# EAGLE design BatNode (EAGLE 7.1.0)
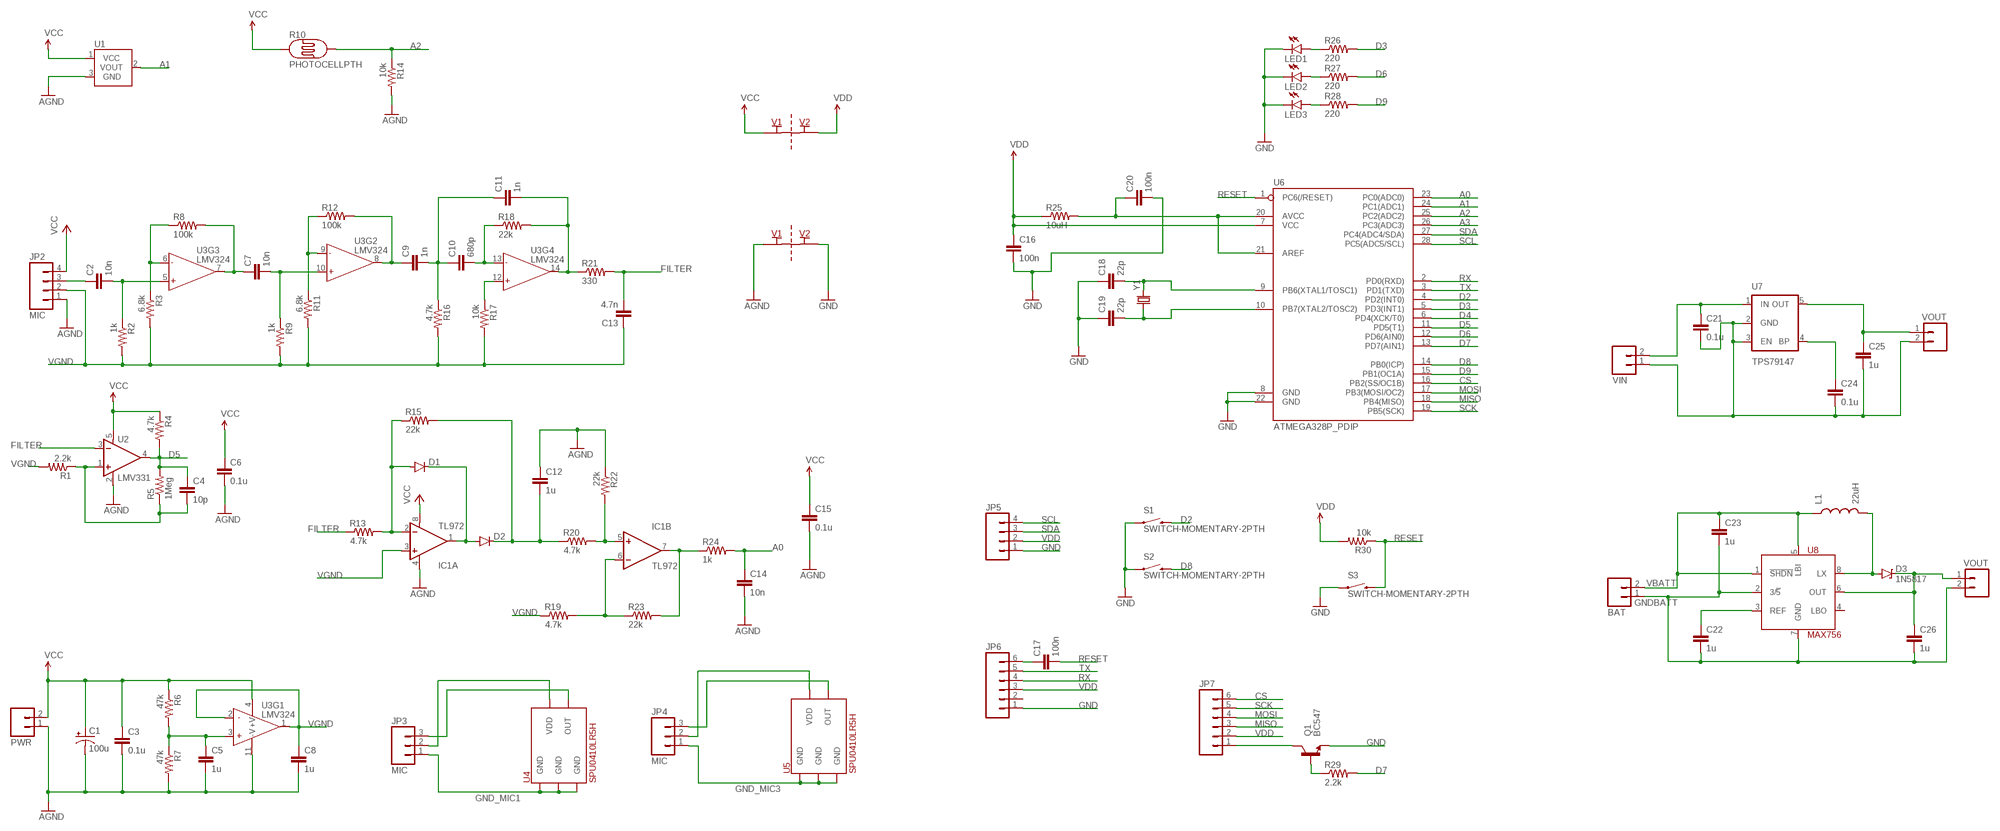
[diagram p0: schematic, sheet 1]

## Parts
C1  100u  CAP_POLPTH1  [CPOL-RADIAL-100UF-25V]
C2  10n  C-EU025-030X050  [C025-030X050]
C3  0.1u  1.0UF-25V-+80/-20(0805)  [0805]
C4  10p  C-EU025-030X050  [C025-030X050]
C5  1u  1.0UF-25V-+80/-20(0805)  [0805]
C6  0.1u  1.0UF-25V-+80/-20(0805)  [0805]
C7  10n  C-EU025-030X050  [C025-030X050]
C8  1u  1.0UF-25V-+80/-20(0805)  [0805]
C9  1n  C-EU025-030X050  [C025-030X050]
C10  680p  C-EU025-030X050  [C025-030X050]
C11  1n  C-EU025-030X050  [C025-030X050]
C12  1u  C-EU025-030X050  [C025-030X050]
C13  4.7n  C-EU025-030X050  [C025-030X050]
C14  10n  C-EU025-030X050  [C025-030X050]
C15  0.1u  1.0UF-25V-+80/-20(0805)  [0805]
C16  100n  CAP0805  [0805]
C17  100n  CAP0805  [0805]
C18  22p  CAPPTH  [CAP-PTH-SMALL]
C19  22p  CAPPTH  [CAP-PTH-SMALL]
C20  100n  CAP0805  [0805]
C21  0.1u  1.0UF-25V-+80/-20(0805)  [0805]
C22  1u  C-EU025-030X050  [C025-030X050]
C23  1u  C-EU025-030X050  [C025-030X050]
C24  0.1u  1.0UF-25V-+80/-20(0805)  [0805]
C25  1u  C-EU025-030X050  [C025-030X050]
C26  1u  C-EU025-030X050  [C025-030X050]
D1  DIODE1N4148  [DIODE-1N4148]
D2  DIODE1N4148  [DIODE-1N4148]
D3  1N5817  DIODE-ZENERPTH  [DIODE-ZENER]
IC1  TL972  OPAMP-DUALU  [SO08]
JP1  PWR  M02LOCK  [1X02_LOCK]
JP2  MIC  M04PTH  [1X04]
JP3  MIC  M03LOCK  [1X03_LOCK]
JP4  MIC  M03LOCK  [1X03_LOCK]
JP5  M04LOCK  [1X04_LOCK]
JP6  M06LOCK  [1X06_LOCK]
JP7  M06LOCK  [1X06_LOCK]
JP8  BAT  M02LOCK  [1X02_LOCK]
JP9  VIN  M02LOCK  [1X02_LOCK]
JP10  VOUT  M02LOCK  [1X02_LOCK]
JP11  VOUT  M02LOCK  [1X02_LOCK]
L1  22uH  INDUCTORC2020  [C2020]
LED1  LED5MM  [LED5MM]
LED2  LED5MM  [LED5MM]
LED3  LED5MM  [LED5MM]
Q1  BC547  TRANSISTOR_NPNBC547  [TO-92-AMMO]
R1  2.2k  RESISTORAXIAL-0.3  [AXIAL-0.3]
R2  1k  RESISTORAXIAL-0.3  [AXIAL-0.3]
R3  6.8k  RESISTORAXIAL-0.3  [AXIAL-0.3]
R4  4.7k  RESISTORAXIAL-0.3  [AXIAL-0.3]
R5  1Meg  RESISTORAXIAL-0.3  [AXIAL-0.3]
R6  47k  RESISTORAXIAL-0.3  [AXIAL-0.3]
R7  47k  RESISTORAXIAL-0.3  [AXIAL-0.3]
R8  100k  RESISTORAXIAL-0.3  [AXIAL-0.3]
R9  1k  RESISTORAXIAL-0.3  [AXIAL-0.3]
R10  PHOTOCELLPTH  [PHOTOCELL]
R11  6.8k  RESISTORAXIAL-0.3  [AXIAL-0.3]
R12  100k  RESISTORAXIAL-0.3  [AXIAL-0.3]
R13  4.7k  RESISTORAXIAL-0.3  [AXIAL-0.3]
R14  10k  RESISTORAXIAL-0.3  [AXIAL-0.3]
R15  22k  RESISTORAXIAL-0.3  [AXIAL-0.3]
R16  4.7k  RESISTORAXIAL-0.3  [AXIAL-0.3]
R17  10k  RESISTORAXIAL-0.3  [AXIAL-0.3]
R18  22k  RESISTORAXIAL-0.3  [AXIAL-0.3]
R19  4.7k  RESISTORAXIAL-0.3  [AXIAL-0.3]
R20  4.7k  RESISTORAXIAL-0.3  [AXIAL-0.3]
R21  330  RESISTORAXIAL-0.3  [AXIAL-0.3]
R22  22k  RESISTORAXIAL-0.3  [AXIAL-0.3]
R23  22k  RESISTORAXIAL-0.3  [AXIAL-0.3]
R24  1k  RESISTORAXIAL-0.3  [AXIAL-0.3]
R25  10uH  RESISTORAXIAL-0.3  [AXIAL-0.3]
R26  220  RESISTORAXIAL-0.3  [AXIAL-0.3]
R27  220  RESISTORAXIAL-0.3  [AXIAL-0.3]
R28  220  RESISTORAXIAL-0.3  [AXIAL-0.3]
R29  2.2k  RESISTORAXIAL-0.3  [AXIAL-0.3]
R30  10k  RESISTORAXIAL-0.3  [AXIAL-0.3]
S1  SWITCH-MOMENTARY-2PTH  [TACTILE-PTH]
S2  SWITCH-MOMENTARY-2PTH  [TACTILE-PTH]
S3  SWITCH-MOMENTARY-2PTH  [TACTILE-PTH]
U1  TMP36GT9  [TO-92]
U2  LMV331  LMV339  [SOT23-5]
U3  LMV324  [SO014]
U4  SPU0410LR5H  [SPU0410LR5H]
U5  SPU0410LR5H  [SPU0410LR5H]
U6  ATMEGA328P_PDIP  [DIL28-3]
U7  TPS79147  V_REG_LDOSMD  [SOT23-5]
U8  MAX756  [SO08]
X11  SUPPLY_CONNECT  [2PT_GND_TIE]
X12  SUPPLY_CONNECT  [2PT_GND_TIE]
Y1  CRYSTALHC49UV  [HC49U-V]

## Nets
A0: C14.1 R24.P$2 U6.23(PC0(ADC0))
A1: U1.2(VOUT) U6.24(PC1(ADC1))
A2: R10.2 R14.P$1 U6.25(PC2(ADC2))
A3: U6.26(PC3(ADC3))
AGND: C1.2(-) C3.2 C5.2 C6.2 C8.2 C12.1 C14.2 C15.2 IC1.4(A:V-) JP1.1 JP2.1 R7.P$2 R14.P$2 R22.P$1 U1.3(GND) U2.2(V-) U3.11(-V) X12.P$1
CS: JP7.6 U6.16(PB2(SS/OC1B))
D2: S1.3 U6.4(PD2(INT0))
D3: R26.P$2 U6.5(PD3(INT1))
D4: U6.6(PD4(XCK/T0))
D5: C4.1 R4.P$2 R5.P$2 U2.4(OUT) U6.11(PD5(T1))
D6: R27.P$2 U6.12(PD6(AIN0))
D7: R29.P$2 U6.13(PD7(AIN1))
D8: S2.3 U6.14(PB0(ICP))
D9: R28.P$2 U6.15(PB1(OC1A))
FILTER: C13.2 R13.P$1 R21.P$2 U2.3(-IN)
GND: C16.2 C18.1 C19.1 C20.2 JP5.1 JP6.1 LED1.K(C) LED2.K(C) LED3.K(C) Q1.3(E) S1.1 S2.1 S3.1 U6.8(GND) U6.22(GND) X12.P$2
GND_MIC1: JP3.1 U4.2(GND) U4.3(GND) U4.5(GND)
GND_MIC3: JP4.1 U5.2(GND) U5.3(GND) U5.5(GND)
GNDBATT: C22.2 C23.2 C26.2 JP8.1 JP11.2 U8.2(3/!5) U8.7(GND)
GNDIN: C21.2 C24.2 C25.2 JP9.1 JP10.2 U7.2(GND) U7.3(EN)
MISO: JP7.3 U6.18(PB4(MISO))
MOSI: JP7.4 U6.17(PB3(MOSI/OC2))
N$1: C5.1 R6.P$2 R7.P$1 U3.3(+IN)
N$2: C2.2 R2.P$1 U3.5(+IN)
N$3: R3.P$1 R8.P$1 U3.6(-IN)
N$4: C7.1 R8.P$2 U3.7(OUT)
N$5: C7.2 R9.P$1 U3.10(+IN)
N$6: C9.1 R12.P$2 U3.8(OUT)
N$7: R11.P$1 R12.P$1 U3.9(-IN)
N$8: C9.2 C10.1 C11.1 R16.P$1
N$9: R17.P$1 U3.12(+IN)
N$10: C10.2 R18.P$1 U3.13(-IN)
N$12: C2.1 JP2.3
N$13: C4.2 R1.P$1 R5.P$1 U2.1(+IN)
N$14: C17.1 JP6.6
N$15: JP3.2 U4.4(VDD)
N$16: JP3.3 U4.1(OUT)
N$17: C18.2 U6.9(PB6(XTAL1/TOSC1)) Y1.2
N$18: C19.2 U6.10(PB7(XTAL2/TOSC2)) Y1.1
N$19: JP7.1 Q1.1(C)
N$20: C20.1 R25.P$2 U6.20(AVCC) U6.21(AREF)
N$21: JP4.2 U5.4(VDD)
N$22: Q1.2(B) R29.P$1
N$23: LED1.A R26.P$1
N$24: LED2.A R27.P$1
N$25: LED3.A R28.P$1
N$26: D3.P$2(A) L1.P$2 U8.8(LX)
N$27: C24.1 U7.4(BP)
N$28: D1.A IC1.2(A:-IN) R13.P$2 R15.P$1
N$29: JP4.3 U5.1(OUT)
N$30: D1.C D2.A IC1.1(A:OUT)
N$31: IC1.5(B:+IN) R20.P$2 R22.P$2
N$32: C12.2 D2.C R15.P$2 R20.P$1
N$33: IC1.6(B:-IN) R19.P$2 R23.P$1
N$34: C26.1 D3.P$1(C) JP11.1 U8.6(OUT)
N$35: C22.1 U8.3(REF)
RESET: C17.2 R30.P$1 S3.3 U6.1(PC6(/RESET))
RX: JP6.4 U6.2(PD0(RXD))
SCK: JP7.5 U6.19(PB5(SCK))
SCL: JP5.4 U6.28(PC5(ADC5/SCL))
SDA: JP5.3 U6.27(PC4(ADC4/SDA))
TX: JP6.5 U6.3(PD1(TXD))
VBATT: C23.1 JP8.2 L1.P$1 U8.1(!SHDN) U8.5(LBI)
VCC: C1.1(+) C3.1 C6.1 C15.1 IC1.8(A:V+) JP1.2 JP2.4 R4.P$1 R6.P$1 R10.1 U1.1(VCC) U2.5(V+) U3.4(+V) X11.P$1
VDD: C16.1 JP5.2 JP6.3 JP7.2 R25.P$1 R30.P$2 U6.7(VCC) X11.P$2
VGND: C8.1 C13.1 IC1.3(A:+IN) JP2.2 R1.P$2 R2.P$2 R3.P$2 R9.P$2 R11.P$2 R16.P$2 R17.P$2 R19.P$1 U3.1(OUT) U3.2(-IN)
VIN: C21.1 JP9.2 U7.1(IN)
VOUT: C25.1 JP10.1 U7.5(OUT)
X1: IC1.7(B:OUT) R23.P$2 R24.P$1
XXX: C11.2 R18.P$2 R21.P$1 U3.14(OUT)
Unconnected: JP6.2 U8.4(LBO)

## Library data of the parts
C1 = SparkFun-Capacitors:CAP_POL: Capacitor Polarized These are standard SMD and PTH capacitors. Normally 10uF, 47uF, and 100uF in electrolytic and tantalum varieties. Always verify the external diameter of the through hole cap, it varies with capacity, voltage, and manufacturer. The EIA devices should be standard.
C2 C4 C7 C9-C14 C22 C23 C25 C26 = resistor:C-EU: CAPACITOR, European symbol; SPICEPREFIX: C
C3 C5 C6 C8 C15 C21 C24 = SparkFun-Capacitors:1.0UF-25V-+80/-20(0805): CAP-11625; PROD_ID: CAP-11625; VALUE: 1.0uF
C16 C17 C20 = SparkFun-Passives:CAP: Capacitor Standard 0603 ceramic capacitor, and 0.1" leaded capacitor.
C18 C19 = SparkFun-Capacitors:CAP: Capacitor Standard 0603 ceramic capacitor, and 0.1" leaded capacitor.
D1 D2 = SparkFun-DiscreteSemi:DIODE: Diode These are standard reverse protection diodes and small signal diodes. SMA package can handle up to about 1A. SOD-323 can handle about 200mA. What the SOD-323 package when ordering, there are some mfgs out there that are 5-pin packages.
D3 = SparkFun-DiscreteSemi:DIODE-ZENER: Zener Diode Production Part - 8199 3.4V Zener Voltage
IC1 = SparkFun-AnalogIC:OPAMP-DUAL: Generic op-amp footprint
JP1 JP8-JP11 = SparkFun-Connectors:M02: Standard 2-pin 0.1" header. Use with - straight break away headers ( PRT-00116) - right angle break away headers (PRT-00553) - swiss pins (PRT-00743) - machine pins (PRT-00117) - female headers (PRT-00115) Molex polarized connector foot print use with: PRT-08233 with associated crimp pins and housings. 2.54_SCREWTERM for use with PRT-10571. 3.5mm Screw Terminal footprints for PRT-08084 5mm Screw Terminal footprints for use with PRT-08432
JP2 JP5 = SparkFun-Connectors:M04: Header 4 Standard 4-pin 0.1" header. Use with straight break away headers (SKU : PRT-00116), right angle break away headers (PRT-00553), swiss pins (PRT-00743), machine pins (PRT-00117), and female headers (PRT-00115). Molex polarized connector foot print use with SKU : PRT-08231 with associated crimp pins and housings. 1MM SMD Version SKU: PRT-10208
JP3 JP4 = SparkFun-Connectors:M03: Header 3 Standard 3-pin 0.1" header. Use with straight break away headers (SKU : PRT-00116), right angle break away headers (PRT-00553), swiss pins (PRT-00743), machine pins (PRT-00117), and female headers (PRT-00115). Molex polarized connector foot print use with SKU : PRT-08232 with associated crimp pins and housings.
JP6 JP7 = SparkFun-Connectors:M06: Header 6 Standard 6-pin 0.1" header. Use with straight break away headers (SKU : PRT-00116), right angle break away headers (PRT-00553), swiss pins (PRT-00743), machine pins (PRT-00117), and female headers (PRT-00115). Molex polarized connector foot print use with SKU : PRT-08094 with associated crimp pins and housings. NOTES ON THE VARIANTS LOCK and LOCK_LONGPADS... This footprint was designed to help hold the alignment of a through-hole component (i.e. 6-pin header) while soldering it into place. You may notice that each hole has been shifted either up or down by 0.005 of an inch from it's more standard position (which is a perfectly straight line). This slight alteration caused the pins (the squares in the middle) to touch the edges of the holes. Because they are alternating, it causes a "brace" to hold the component in place. 0.005 has proven to be the perfect amount of "off-center" position when using our standard breakaway headers. Although looks a little odd when you look at the bare footprint, once you have a header in there, the alteration is very hard to notice. Also,if you push a header all the way into place, it is covered up entirely on the bottom side. This idea of altering the position of holes to aid alignment will be further integrated into the Sparkfun Library for other footprints. It can help hold any component with 3 or more connection pins.
L1 = BatNodeParts:INDUCTOR: Inductors Basic Inductor/Choke - 0603 and 1206. Footprints are not proven and vary greatly between part numbers. SRN6045- 33uH, 20% 1.4A SDR0403-560KL - 56uH, 10%, 500mA RMS/740mA peak
LED1-LED3 = SparkFun-LED:LED: LEDs Standard schematic elements and footprints for 5mm, 3mm, 1206, and 0603 sized LEDs. 5mm - Spark Fun Electronics SKU : COM-00529 (and others)
Q1 = SparkFun-DiscreteSemi:TRANSISTOR_NPN: Generic NPN BJT MMBT2222A - TRANS-08049 (SOT-23, 1A 40V) MPSA42 - TRANS-09116 (SOT-23, 500mA 300V) MMBT5088LT1G - TRANS-11160 (SOT-23, 50 mA 30V) BC547 - COM-08928 <http://www.sparkfun.com/products/8928> (TO-92 45V 100mA) (1.Collector 2.Base 3.Emitter) 2N3904 - COM-00521 <http://www.sparkfun.com/products/521> (TO-92 40V 200mA) (1.Emitter 2.Base 3.Collector) P2N2222A - COM-12852 <http://www.sparkfun.com/products/12852> (TO-92 40V 600mA) (1.Collector 2.Base 3.Emitter)
R1-R9 R11-R25 = SparkFun-Passives:RESISTOR: Resistor Basic schematic elements and footprints for 0603, 1206, and PTH resistors.
R10 = SparkFun-Sensors:PHOTOCELL: CdS photoresistor. This is a low cost way to detect light levels. Resistance decreases with more incoming light. SparkFun SKU: SEN-09088
R26-R30 = SparkFun-Resistors:RESISTOR: Resistor Basic schematic elements and footprints for 0603, 1206, and PTH resistors.
S1-S3 = SparkFun-Electromechanical:SWITCH-MOMENTARY-2: Various NO switches- pushbuttons, reed, etc
U1 = SparkFun-Sensors:TMP36: Precision degC temp sensor, analog out
U2 = BatNodeParts:LMV339: LMV339 Comparator
U3 = SparkFun-AnalogIC:LMV324: Jellybean quad op-amp; PROD_ID: IC-08227
U4 U5 = BatNodeParts:SPU0410LR5H
U6 = SparkFun-DigitalIC:ATMEGA328P_PDIP: uC used in the Arduino 32kb flash, 1k EEPROM, 2k SRAM This is the through-hole version of this chip.
U7 = SparkFun-PowerIC:V_REG_LDO: Voltage Regulator LDO Standard 150mA LDO voltage regulator in SOT-23 layout. Micrel part MIC5205. BP (by-pass) pin is used to lower output noise with 470pF cap.
U8 = BatNodeParts:MAX756
X11 X12 = SparkFun-Passives:SUPPLY_CONNECT
Y1 = SparkFun-FreqCtrl:CRYSTAL: Various standard crystals. Proven footprints.

## Board
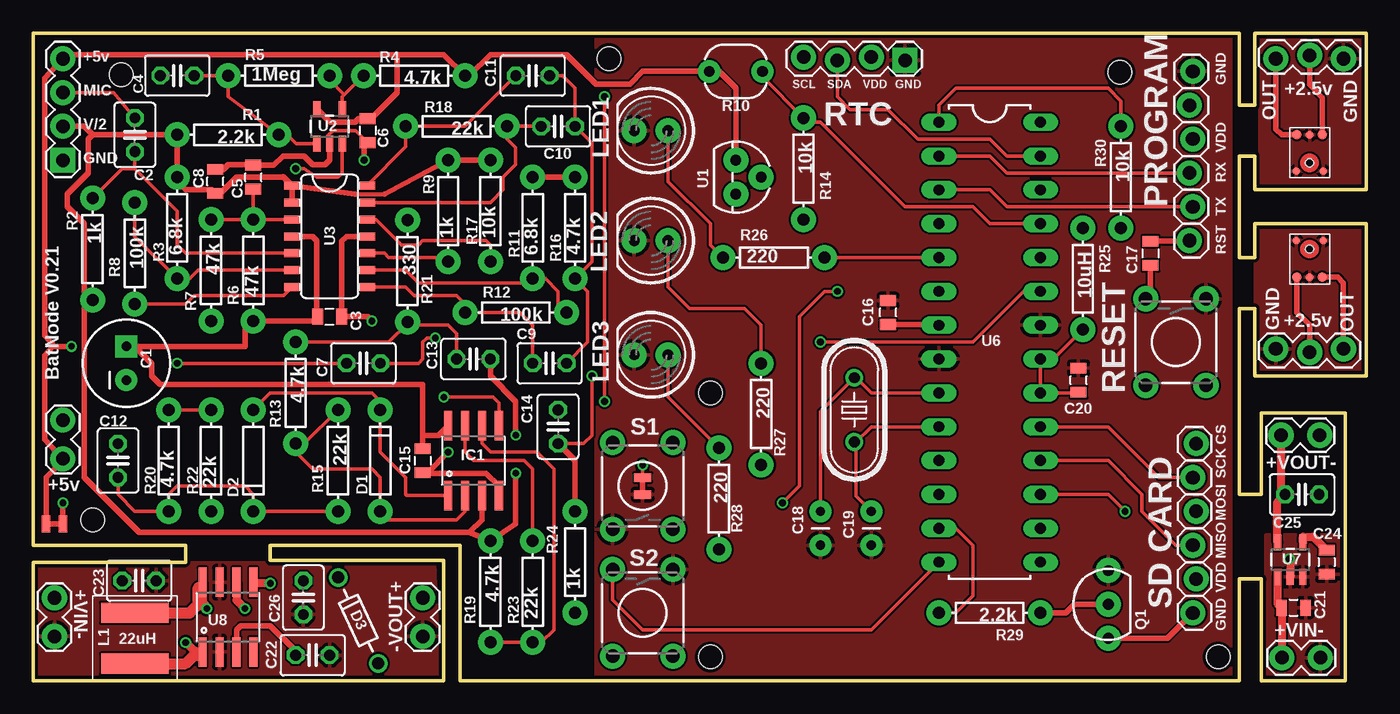
[diagram p1: board, top side]
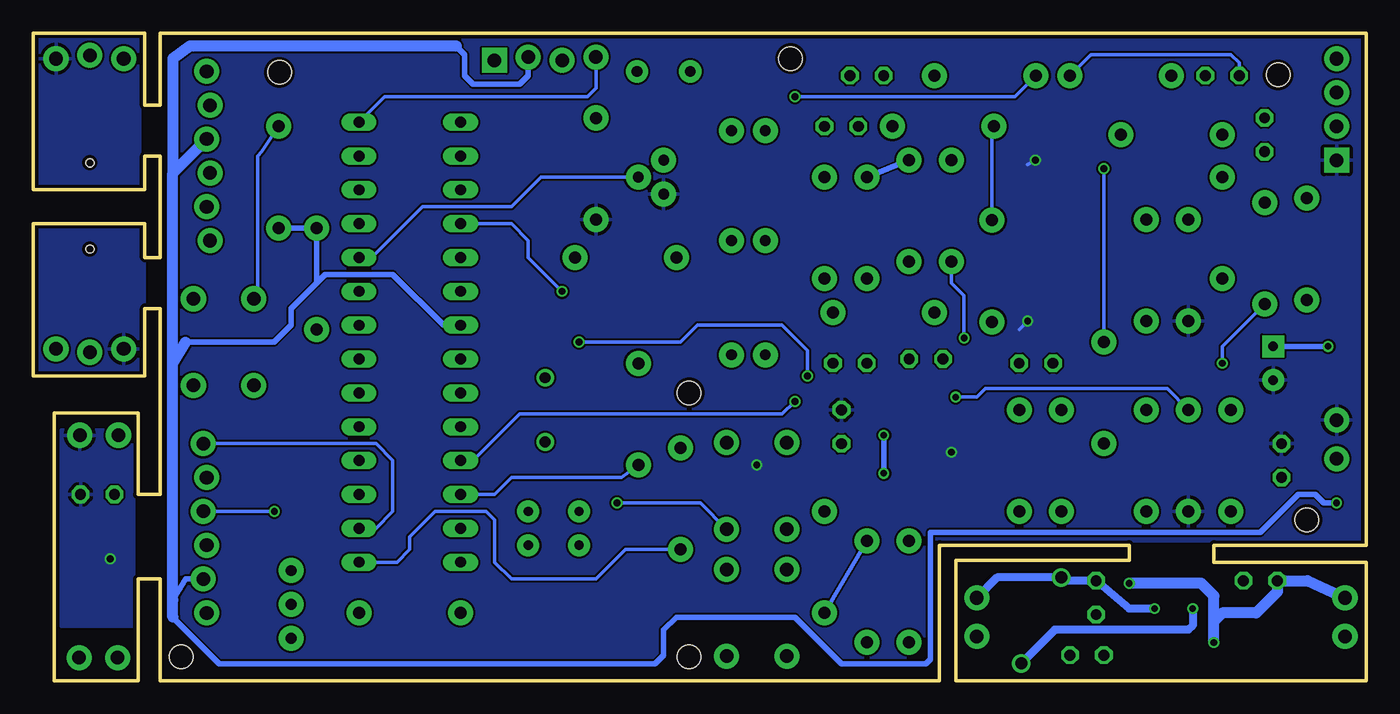
[diagram p2: board, bottom side, seen from below]

Size 100 x 48.58 mm. Coordinates in mm from the lower left corner, seen from the top.
Outline: 90.49,0 32,0 32,10.16 17.78,10.16 17.78,9.02 30.8,9.02 30.8,0 0,0 0,8.89 11.43,8.89 11.43,10.16 0,10.16 0,48.58 90.49,48.58 90.49,43.18 91.63,43.18 91.63,48.58 100,48.58 100,36.83 91.63,36.83 91.63,39.37 90.49,39.37 90.49,31.75 91.63,31.75 91.63,34.29 100,34.29 100,22.86 91.63,22.86 91.63,27.94 90.49,27.94 90.49,13.97 92.14,13.97 92.14,20.07 98.42,20.07 98.42,0 92.14,0 92.14,7.62 90.49,7.62 90.49,0
Copper layers (1*16): Top 0.035mm / dielectric 1.5mm / Bottom 0.035mm
Design rules "ITEADstudio_DRC": minimum track width 6mil, minimum drill 12mil, track to track 6mil, track to pad 6mil, pad to pad 6mil, via to via 6mil, smd to smd 0mil, copper to edge 10mil, drill to drill 10mil, minimum pad ring 10mil, minimum via ring 6mil, stop-mask expansion 2mil, vias tented up to drill 100mil, thermal gap 10mil
Holes 1.78 mm at 50.8,1.78 50.8,21.59 88.9,1.78 43.18,46.67 4.45,12.06 6.6,45.47 81.53,45.66

### Footprints (pad centres in the part's own frame; a part is rotated, then mirrored left to right if it is on the bottom)
CPOL-RADIAL-100UF-25V = drill 0.7 pad 1.651 square: 1 1.27,0 | drill 0.7 pad 1.651: 2 -1.27,0
C025-030X050 = drill 0.813 octagon: 1 -1.27,0; 2 1.27,0
0805 = smd 0.8 x 1.2: 1 -0.9,0; 2 0.9,0
CAP-PTH-SMALL = drill 0.7 pad 1.651: 1 0,0; 2 2.54,0
DIODE-1N4148 = drill 0.9 pad 1.88: A -3.81,0; C 3.81,0
DIODE-ZENER = drill 0.9: P$1 -3.556,0; P$2 3.556,0
SO08 = smd 0.61 x 2.21: 1 -1.905,-2.616; 2 -0.635,-2.616; 3 0.635,-2.616; 4 1.905,-2.616; 5 1.905,2.616; 6 0.635,2.616; 7 -0.635,2.616; 8 -1.905,2.616
1X02_LOCK = drill 1.016 pad 1.88: 1 -0.178,0; 2 2.718,0
1X04 = drill 1.016 pad 1.88 square: 1 0,0 | drill 1.016 pad 1.88: 2 2.54,0; 3 5.08,0; 4 7.62,0
1X03_LOCK = drill 1.016 pad 1.88: 1 0,0.127; 2 2.54,-0.127; 3 5.08,0.127
1X04_LOCK = drill 1.016 pad 1.88 square: 1 0,0.127 | drill 1.016 pad 1.88: 2 2.54,-0.127; 3 5.08,0.127; 4 7.62,-0.127
1X06_LOCK = drill 1.016 pad 1.88: 1 0,0; 2 2.54,-0.254; 3 5.08,0; 4 7.62,-0.254; 5 10.16,0; 6 12.7,-0.254
C2020 = smd 1.524 x 5.08: P$1 -1.905,0; P$2 1.905,0
LED5MM = drill 0.813 pad 1.88: A -1.27,0; K 1.27,0
TO-92-AMMO = drill 0.813 pad 1.88: 1 -2.54,0; 2 0,0; 3 2.54,0
AXIAL-0.3 = drill 0.9 pad 1.88: P$1 -3.81,0; P$2 3.81,0
PHOTOCELL = drill 0.8 pad 1.676: 1 -2,0; 2 2,0
TACTILE-PTH = drill 1.016 pad 1.88: 1 -3.251,2.261; 2 3.251,2.261; 3 -3.251,-2.261; 4 3.251,-2.261
TO-92 = drill 0.813 pad 1.88: 1 -1.27,0; 2 0,1.905; 3 1.27,0
SOT23-5 = smd 0.55 x 1.2: 1 -0.95,-1.3; 2 0,-1.3; 3 0.95,-1.3; 4 0.95,1.3; 5 -0.95,1.3
SO014 = smd 0.6 x 1.2: 1 -3.175,-2.8; 2 -1.905,-2.8; 3 -0.635,-2.8; 4 0.635,-2.8; 5 1.905,-2.8; 6 3.175,-2.8; 7 4.445,-2.8; 8 4.445,2.8; 9 3.175,2.8; 10 1.905,2.8; 11 0.635,2.8; 12 -0.635,2.8; 13 -1.905,2.8; 14 -3.175,2.8
SPU0410LR5H = smd 0.723 x 0.723: 1 -0.966,2.103; 4 0.966,2.103 | smd 0.562 x 0.562: 2 -1.015,-0.634; 3 1.015,-0.634 | smd 0.612 x 0.612: 5 0,2.103 | hole 0.61: 0,0
DIL28-3 = drill 0.813 long: 1 -16.51,-3.81; 2 -13.97,-3.81; 3 -11.43,-3.81; 4 -8.89,-3.81; 5 -6.35,-3.81; 6 -3.81,-3.81; 7 -1.27,-3.81; 8 1.27,-3.81; 9 3.81,-3.81; 10 6.35,-3.81; 11 8.89,-3.81; 12 11.43,-3.81; 13 13.97,-3.81; 14 16.51,-3.81; 15 16.51,3.81; 16 13.97,3.81; 17 11.43,3.81; 18 8.89,3.81; 19 6.35,3.81; 20 3.81,3.81; 21 1.27,3.81; 22 -1.27,3.81; 23 -3.81,3.81; 24 -6.35,3.81; 25 -8.89,3.81; 26 -11.43,3.81; 27 -13.97,3.81; 28 -16.51,3.81
2PT_GND_TIE = smd 1.27 x 0.635: P$1 0,0.635; P$2 0,-0.635
HC49U-V = drill 0.813: 1 -2.413,0; 2 2.413,0

### Placement (x,y rotation side)
C1  6.99,23.81 90 top
C2  7.62,40.96 270 top
C3  22.23,27.32 0 top
C4  10.79,45.4 0 top
C5  16.51,37.78 90 top
C6  25.08,41.27 270 top
C7  24.77,23.81 0 top
C8  13.65,37.47 90 top
C9  38.73,23.81 0 top
C10  39.37,41.59 180 top
C11  37.47,45.4 180 top
C12  6.35,16.51 270 top
C13  33.02,24.13 180 top
C14  39.37,19.05 90 top
C15  29.21,16.51 270 top
C16  64.14,27.62 90 top
C17  83.82,32.07 270 top
C18  59.05,10.16 90 top
C19  62.87,10.16 90 top
C20  78.42,22.54 90 top
C21  94.55,5.46 0 top
C22  20.95,1.91 0 top
C23  7.94,7.49 0 top
C24  97.03,8.89 270 top
C25  95.19,13.97 0 top
C26  20.26,6.22 270 top
D1  26.04,16.51 90 top
D2  16.51,16.51 270 top
D3  24.38,4.51 295 top
IC1  33.02,16.51 0 top
JP1  2.22,19.37 270 top
JP2  2.22,39.05 90 top
JP3  98.3,46.8 180 top
JP4  93.22,24.77 0 top
JP5  65.41,46.67 180 top
JP6  87,45.72 270 top
JP7  87,5.08 90 top
JP8  1.59,3.49 90 top
JP9  96.39,1.71 180 top
JP10  93.79,18.41 0 top
JP11  29.21,6.03 270 top
L1  7.62,3.17 90 top
LED1  46.35,41.27 180 top
LED2  46.35,33.02 180 top
LED3  46.35,24.45 180 top
Q1  80.64,5.71 90 top
R1  14.61,40.96 180 top
R2  4.45,32.38 270 top
R3  10.79,33.97 90 top
R4  28.57,45.4 180 top
R5  18.41,45.4 0 top
R6  16.51,30.8 90 top
R7  13.34,30.8 270 top
R8  7.62,32.07 270 top
R9  31.11,35.24 90 top
R10  52.7,45.72 0 top
R11  37.47,33.97 90 top
R12  36.2,27.62 180 top
R13  19.68,21.59 270 top
R14  57.78,38.42 270 top
R15  22.86,16.51 270 top
R16  40.64,33.97 90 top
R17  34.29,35.24 90 top
R18  31.75,41.59 180 top
R19  34.29,6.67 270 top
R20  10.16,16.51 90 top
R21  28.07,30.73 270 top
R22  13.34,16.51 90 top
R23  37.47,6.67 90 top
R24  40.64,8.89 90 top
R25  78.74,30.16 270 top
R26  55.56,31.75 0 top
R27  54.61,20 270 top
R28  51.44,13.65 270 top
R29  71.75,5.08 180 top
R30  81.6,37.78 270 top
S1  45.72,14.61 90 top
S2  45.72,5.08 270 top
S3  85.72,25.4 270 top
U1  52.7,37.78 270 top
U2  22.23,41.59 0 top
U3  22.23,33.97 270 top
U4  95.76,38.86 0 top
U5  95.76,32.38 180 top
U6  71.75,25.4 270 top
U7  94.3,9.08 0 top
U8  14.61,4.76 0 top
X11  1.59,11.75 90 top
X12  45.72,14.61 0 top
Y1  61.59,20.32 90 top

### Tracks (layer width: path | path; a pad name or v marks a point on that pad's centre or on a via)
A0  (via drill 0.51)
  Top 0.254: U6.23 74.3,29.21 70.48,25.4 v59.05,25.4 | v41.91,22.86 41.91,18.41 41.27,17.78 C14.1
  Top 0.406: R24.P$2 40.64,16.51 C14.1
  Bottom 0.254: v59.05,25.4 51.44,25.4 50.16,26.67 43.81,26.67 41.91,24.77 v41.91,22.86
A1
  Bottom 0.254: U6.24 74.61,31.75 70.8,35.56 64.14,35.56 61.91,37.78 U1.2
A2
  Top 0.254: R10.2 54.7,45.31 R14.P$1 58.1,41.91 59.05,41.91 65.41,35.56 70.48,35.56 71.75,34.29 U6.25
AGND  (via drill 0.51)
  Top 0.254: IC1.4 34.92,14.61 | C15.2 29.26,15.56 29.53,15.56 | 22.23,40.32 U2.2 | 22.23,40.64 U2.2 | 24.83,40.12 C6.2 24.18,41.27 22.48,41.27 22.1,40.89 22.1,40.42 U2.2 | X12.P$1 v45.72,16.19
  Top 0.406: U3.11 23.5,33.34 23.12,32.97 C3.2 25.07,27.32 v25.4,26.99 | 34.92,14.61 33.97,15.56 29.53,15.56 v31.11,17.14 | U2.2 22.23,39.05 21.91,38.73 20.95,38.73 20.32,39.37 18.73,39.37 18.05,38.68 C5.2 16.46,38.73 14.61,38.73 14.23,38.37 C8.2 | 24.83,40.12 v24.83,39.05
  Bottom 0.254: v25.4,26.99 26.04,26.35 | v24.83,39.05 25.4,38.73
  pour Bottom: 0,48.26 0,10.48 31.75,10.48 31.75,0 89.85,0 89.85,48.26
CS
  Bottom 0.254: JP7.6 74.3,17.78 73.03,16.51 73.03,12.7 74.3,11.43 U6.16
D2  (via drill 0.51)
  Top 0.254: v60.33,29.21 59.37,29.21 57.47,27.3 57.47,14.61 v56.2,13.34
  Bottom 0.254: U6.4 64.14,34.29 62.87,33.02 62.87,31.75 v60.33,29.21 | v56.2,13.34 49.96,13.34 S1.3
D3
  Top 0.254: R26.P$2 U6.5
D5  (via drill 0.51)
  Top 0.254: R4.P$2 23.34,43.97 | 23.34,43.97 23.18,43.81 U2.4 | v42.86,20.95 v42.86,43.81 | R5.P$2 22.23,45.09 23.34,43.97
  Bottom 0.254: R4.P$2 26.35,43.81 v42.86,43.81 | R5.P$2 20.64,46.99 10.16,46.99 9.53,46.35 C4.1 | U6.11 66.99,16.51 63.5,20 43.81,20 v42.86,20.95
D6
  Bottom 0.254: R27.P$2 55.88,15.24 64.14,15.24 65.41,13.97 U6.12
D7
  Top 0.254: R29.P$2 69.22,5.08 70.48,6.35 70.48,10.16 69.22,11.43 U6.13
D8
  Top 0.254: S2.3 43.46,6.07 45.72,3.81 62.87,3.81 U6.14
D9
  Bottom 0.254: R28.P$2 55.56,9.84 57.78,7.62 64.14,7.62 65.41,8.89 65.41,12.06 66.04,12.7 69.85,12.7 71.75,10.79 71.75,9.84 72.71,8.89 U6.15
FILTER  (via drill 0.51)
  Top 0.254: U2.3 23.18,38.1 22.86,37.78 21.27,37.78 20.32,38.42 v19.68,38.42 | R13.P$1 26.67,25.4 28.07,26.8 R21.P$2 28.07,26.86 28.26,26.67 31.11,26.67 31.75,26.04 C13.2
  Bottom 0.254: R13.P$1 v19.68,38.42
GND
  Top 0.254: U6.8 66.67,24.13
  pour Top: 42.23,48.26 42.23,0 89.85,0 89.85,48.26
GND_MIC1
  pour Top: 99.89,37.08 99.89,48.39 92.01,48.39 92.01,37.08
  pour Bottom: 92.01,37.08 92.01,48.39 99.89,48.39 99.89,37.08
GND_MIC3
  pour Bottom: 99.89,33.91 99.89,23.18 91.69,23.18 91.69,33.91
  pour Top: 91.69,33.91 91.69,23.18 99.89,23.18 99.89,33.91
GNDBATT
  pour Top: -0.06,8.83 0.32,0.32 30.48,0.32 30.1,8.83
GNDIN  (via drill 0.51)
  Top 0.254: 94.36,7.84 U7.2
  Top 0.61: 94.36,7.84 94.36,9.02 v94.23,9.14
  pour Top: 92.46,10.92 97.92,10.92 97.92,0.25 92.46,0.13
  pour Bottom: 92.46,4.06 97.92,4.06 97.92,18.8 92.46,18.8
MISO
  Top 0.254: JP7.3 85.72,10.16 83.19,12.7 83.19,13.97 80.64,16.51 U6.18
MOSI  (via drill 0.51)
  Top 0.254: U6.17 80.64,13.97 v81.92,12.7
  Bottom 0.254: JP7.4 v81.92,12.7
N$1
  Top 0.254: R7.P$1 R6.P$2 | R6.P$2 U3.3 | R6.P$2 C5.1
N$2
  Top 0.254: 7.62,38.42 10.79,35.24 10.79,32.7 11.43,32.07 U3.5 | C2.2 7.62,38.42 | 7.62,38.42 6.67,38.42 R2.P$1
N$3
  Top 0.254: R8.P$1 7.62,33.34 R3.P$1 11.75,30.16 12.38,30.8 U3.6
N$4  (via drill 0.51)
  Top 0.254: R8.P$2 11.43,28.26 12.06,28.89 18.79,28.89 U3.7 | C7.1 v10.79,23.81
  Bottom 0.254: v10.79,23.81 10.79,25.08 R8.P$2
N$5  (via drill 0.51)
  Top 0.254: U3.10 26.35,32.07 26.67,31.75 30.8,31.75 R9.P$1 | C7.2 28.89,23.81 29.21,24.13 29.21,25.4 29.53,25.72 v30.16,25.72
  Bottom 0.254: R9.P$1 31.11,29.84 30.16,28.89 v30.16,25.72
N$6
  Top 0.254: U3.8 27.94,29.53 28.57,28.89 31.75,28.89 32.38,28.26 R12.P$2 36.51,27.62 37.47,26.67 C9.1
N$7
  Top 0.254: U3.9 27.94,30.8 28.89,29.84 37.15,29.84 R11.P$1 38.42,30.16 39.37,29.21 39.37,28.26 R12.P$1
N$8
  Top 0.254: C9.2 41.59,25.4 41.59,29.21 R16.P$1 41.91,31.43 41.91,40.32 C10.1 40.64,44.45 39.69,45.4 C11.1
N$9
  Top 0.254: U3.12 25.72,34.61 27.62,32.7 28.89,32.7 29.21,33.02 33.97,33.02 34.29,32.7 R17.P$1
N$10
  Top 0.254: C10.2 R18.P$1 35.56,40.64 36.2,40.01 36.2,38.73 35.24,37.78 35.24,36.83 34.29,35.88 U3.13
N$12
  Top 0.254: JP2.3 6.03,44.13 C2.1
N$13
  Top 0.254: U2.1 19.71,40.29 19.05,40.96 R1.P$1 14.61,43.81 R5.P$1 C4.2
N$14
  Top 0.406: C17.1 86.69,32.97 JP6.6
N$15
  Top 0.406: U4.4 96.72,43.74 95.76,44.7 JP3.2
N$16
  Top 0.406: U4.1 93.66,40.97 93.22,41.4 JP3.3
N$17
  Top 0.254: U6.9 62.87,21.59 61.72,22.73 Y1.2 59.05,20.19 C18.2
N$18
  Top 0.254: Y1.1 61.72,17.91 | 61.72,17.91 62.87,19.05 U6.10 | 61.72,17.91 61.72,13.84 C19.2
N$19
  Top 0.406: Q1.1 85.09,3.17 JP7.1
N$20
  Top 0.254: C20.1 78.37,21.59 U6.20 U6.21 76.52,24.13 R25.P$2
N$21
  Top 0.406: U5.4 94.79,27.64 95.76,26.67 JP4.2
N$22
  Top 0.406: R29.P$1 77.47,5.08 78.11,5.71 Q1.2
N$23
  Top 0.254: LED1.A 47.62,37.47 50.8,34.29 50.8,32.7 R26.P$1
N$24
  Top 0.254: R27.P$1 54.61,26.67 53.34,27.94 49.21,27.94 47.62,29.53 LED2.A
N$25
  Top 0.254: LED3.A 47.62,21.27 R28.P$1
N$26  (via drill 0.51)
  Top 0.61: U8.8 12.7,5.71
  Top 0.813: L1.P$2 11.75,5.08 12.38,5.71 | 12.38,5.71 12.38,6.99 | 12.38,5.71 12.7,5.71 v13.02,5.4
  Bottom 0.61: v13.02,5.4 13.02,4.13 13.34,3.81 23.36,3.81 D3.P$2
N$27
  Top 0.61: U7.4 95.25,10.79 96.02,10.79 C24.1
N$28
  Top 0.254: IC1.2 32.38,12.7 31.75,12.06 26.67,12.06 D1.A 26.04,15.24 25.4,15.88 20.95,15.88 19.68,17.14 R13.P$2 20.32,17.78 R15.P$1
N$29
  Top 0.406: U5.1 97.86,30.28 98.3,29.84 JP4.3
N$30
  Top 0.254: IC1.1 28.02,13.89 27.94,13.97 27.94,15.24 26.04,17.14 D1.C 26.04,20.95 25.4,21.59 17.78,21.59 D2.A
N$31  (via drill 0.51)
  Top 0.254: R22.P$2 R20.P$2 | v30.8,21.27 34.48,21.27 34.92,20.83 IC1.5
  Bottom 0.254: v30.8,21.27 29.21,21.27 28.57,21.91 14.92,21.91 R22.P$2
N$32
  Top 0.254: R15.P$2 D2.C 16.51,13.97 15.88,14.61 10.79,14.61 10.16,13.97 R20.P$1 7.62,12.7 6.35,13.97 C12.2
N$33
  Top 0.254: R19.P$2 R23.P$1 38.1,2.86 39.05,3.81 39.05,15.88 37.78,17.14 34.29,17.14 33.66,17.78 IC1.6
N$34  (via drill 0.51)
  Top 0.61: U8.6 15.24,6.03 v15.88,5.4
  Bottom 0.61: v15.88,5.4 17.78,5.4 C26.1 22.64,7.49 D3.P$1 27.69,7.73 JP11.1
N$35
  Top 0.406: U8.3 15.24,3.81 15.56,4.13 17.78,4.13 19.68,2.22 C22.1
RESET
  Top 0.254: 83.5,28.69 S3.3 | U6.1 67.94,43.18 69.22,44.45 80.64,44.45 81.6,43.5 R30.P$1
  Top 0.406: C17.2 83.82,29.01 S3.3
  Bottom 0.254: R30.P$1 82.87,39.69 83.19,39.37 83.19,28.93 S3.3
RX
  Top 0.254: JP6.4 73.03,38.1 71.75,39.37 U6.2
SCK
  Top 0.254: U6.19 80.64,19.05 84.45,15.24 JP7.5
SCL
  Bottom 0.254: JP5.4 57.78,44.45 58.42,43.81 73.66,43.81 U6.28
SDA
  Top 0.254: JP5.3 60.33,43.81 61.28,42.86 64.14,42.86 66.36,40.64 71.75,40.64 73.03,39.37 U6.27
TX
  Top 0.254: JP6.5 73.03,35.56 71.75,36.83 U6.3
VBATT  (via drill 0.51)
  Top 0.305: U8.1 12.14,2.15 | 16.59,7.3 U8.5
  Top 0.61: 12.14,2.15 v11.43,2.86 | v17.78,7.3 16.59,7.3
  Top 0.813: L1.P$1 11.43,1.27 12.06,1.91 | 12.06,1.91 12.46,1.91 | 12.14,2.15 12.14,1.98 12.06,1.91
  Bottom 0.813: v11.43,2.86 11.43,4.45 | 11.43,4.45 10.79,5.08 8.26,5.08 6.67,6.67 C23.1 4.39,7.49 JP8.2 | 11.43,4.45 11.43,6.35 12.38,7.3 v17.78,7.3
VCC  (via drill 0.51)
  Top 0.254: 21.27,27.37 C3.1 21,26.99 | 25.35,42.17 C6.1
  Top 0.406: U3.4 20.95,33.34 21.27,33.02 21.27,27.37 | 27.3,46.99 2.54,46.99 JP2.4 0.84,45.21 0.84,25.91 1.59,25.08 v2.86,25.08 1.46,25.08 0.84,24.38 0.84,18.11 JP1.2 2.22,16.51 0.95,15.24 X11.P$1 | 27.3,46.99 30.8,46.99 R4.P$1 32.7,45.4 34.29,46.99 40.01,46.99 42.23,44.77 44.77,44.77 45.72,45.72 R10.1 51.44,45.72 52.7,44.45 U1.1 | C1.1 7.62,25.08 | 7.62,25.08 15.88,25.08 15.88,26.35 R6.P$1 21,26.99 | 27.3,46.99 27.3,44.13 25.35,42.17 | 7.62,25.08 8.89,23.81 8.89,22.86 9.53,22.23 29.21,22.23 29.21,18.41 | C15.1 29.21,18.41 | 29.21,18.41 30.4,18.41 IC1.8 | U2.5 22.26,41.91 24.13,41.91 24.39,42.17 C6.1
  Bottom 0.406: v2.86,25.08 C1.1
VDD  (via drill 0.51)
  Top 0.406: X11.P$2 v2.22,13.34 | C16.1 67.89,26.72 U6.7
  Bottom 0.406: JP7.2 88.58,7.62 89.53,6.03 | JP5.2 62.87,45.4 63.5,44.77 66.99,44.77 67.63,45.4 67.63,46.99 68.26,47.62 | 78.74,29.84 R25.P$1 R30.P$2 | 78.74,29.84 80.64,27.94 80.64,26.67 81.92,25.4 88.58,25.4 | U6.7 69.22,26.67 73.03,30.48 78.11,30.48 78.74,29.84 | v2.22,13.34 3.17,13.34 3.81,13.97 5.08,13.97 7.94,11.11 32.7,11.11 32.7,1.59 33.02,1.27 39.37,1.27 42.86,4.76 51.75,4.76 52.7,3.81 52.7,1.91 53.34,1.27 86.04,1.27 89.53,4.76
  Bottom 0.813: 89.53,4.76 89.53,6.03 89.53,23.81 | 89.53,23.81 89.53,38.1 | 89.53,38.1 JP6.3 | 89.53,38.1 89.53,46.67 88.27,47.62 68.26,47.62 | 88.58,25.4 89.53,23.81
VGND  (via drill 0.51)
  Top 0.305: 24.13,36.51 26.35,36.51
  Top 0.406: U3.1 U3.2 | U3.1 18.74,37.84 18.68,37.78 15.24,37.78 14.02,36.56 C8.1 13.39,36.83 11.43,36.83 10.79,37.47 R3.P$2 R1.P$2 4.45,40.96 | U3.1 24.13,36.51 | 26.35,36.51 R9.P$2 R17.P$2 | IC1.3 33.66,12.06 32.7,11.11 | 32.7,11.11 7.94,11.11 3.81,15.24 3.81,27.94 R2.P$2 3.81,29.21 3.81,34.29 2.54,35.56 2.54,36.51 4.13,38.1 4.13,40.64 4.45,40.96 | JP2.2 3.81,41.59 4.45,40.96 | 32.7,11.11 R19.P$1 36.2,11.75 v36.2,15.56 | C13.1 34.29,22.86 36.2,20.95 v36.2,18.41 | R11.P$2 R16.P$2
  Bottom 0.406: R17.P$2 R11.P$2 | v36.2,18.41 v36.2,15.56
VIN
  Top 0.61: JP9.2 93.65,1.74 C21.1 93.35,5.76 U7.1
VOUT
  Top 0.61: U7.5 93.35,13.4 C25.1 93.61,14.28 JP10.1
X1
  Top 0.254: IC1.7 32.38,17.14 33.02,16.51 36.83,16.51 37.47,15.88 R23.P$2
  Bottom 0.254: R23.P$2 R24.P$1
XXX
  Top 0.254: U3.14 27.94,40.06 R18.P$2 32.38,41.59 C11.2
  Bottom 0.254: R21.P$1 28.07,41.47 R18.P$2

### Text on the board
tPlace: +5v | GND | OUT | +2.5v | GND | MIC | SCL | SDA | VDD | GND | RTC | V/2 | VDD | GND | RX | PROGRAM | TX | RST | +2.5v | GND | OUT | BatNode V0.21 | RESET | CS | +VOUT- | +5v | SCK | MOSI | MISO | +VIN- | VDD | SD CARD | GND | +VIN- | -VOUT+